# EAGLE design main (EAGLE 5.04)
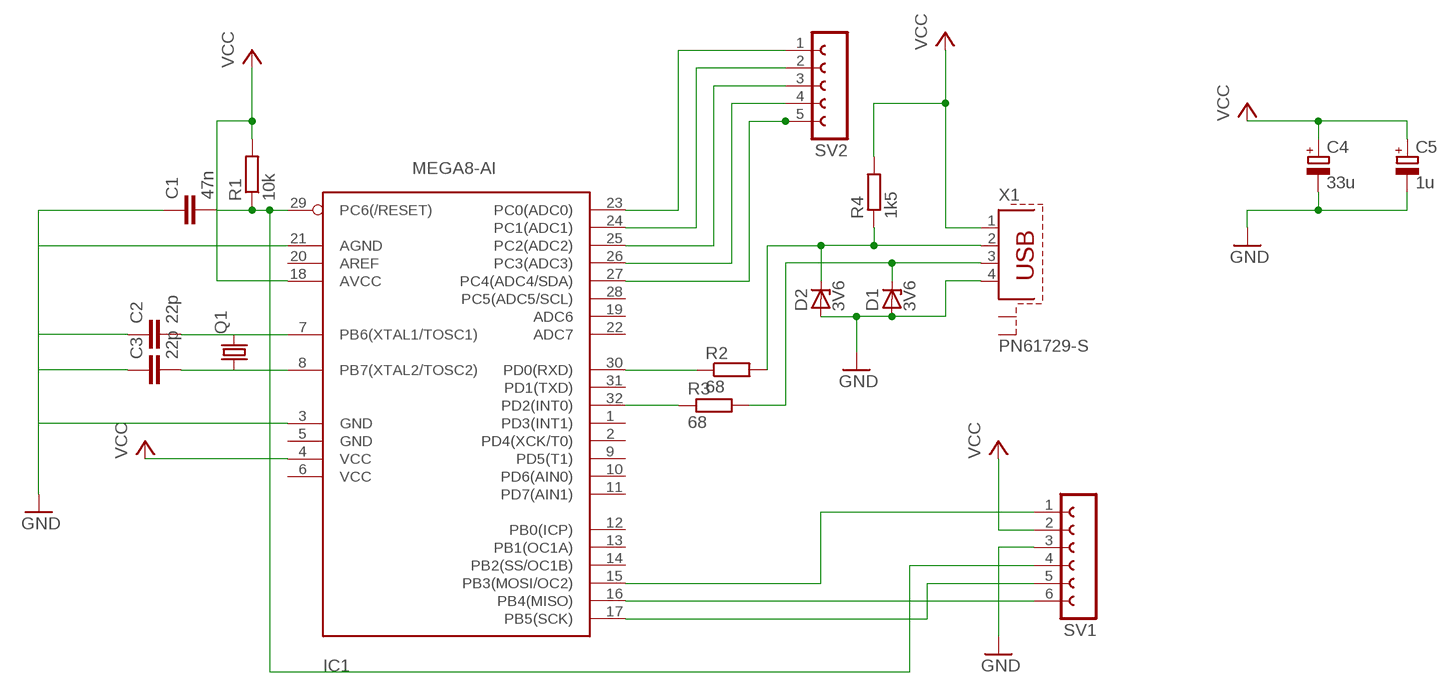
[diagram p0: schematic, sheet 1]

## Parts
C1  47n  C5/3  [C5B3]
C2  22p  C2.5/2  [C2.5-2]
C3  22p  C2.5/2  [C2.5-2]
C4  33u  CPOL-EUE2-4  [E2-4]
C5  1u  CPOL-EUE2-4  [E2-4]
D1  3V6  ZENER-DIODEDO34-7  [DO34Z7]
D2  3V6  ZENER-DIODEDO34-7  [DO34Z7]
IC1  MEGA8-AI  [TQFP32-08]
Q1  CRYSTALHC49S  [HC49/S]
R1  10k  R-EU_0207/10  [0207/10]
R2  68  R-EU_0207/10  [0207/10]
R3  68  R-EU_0207/10  [0207/10]
R4  1k5  R-EU_0207/10  [0207/10]
SV1  FE06-1  [FE06]
SV2  FE05-1  [FE05-1]
X1  PN61729-S  [PN61729-S]

## Nets
GND: C1.1 C2.1 C3.1 C4.- C5.- D1.A D2.A IC1.3(GND) IC1.21(AGND) SV1.3 X1.4
N$1: C2.2 IC1.7(PB6(XTAL1/TOSC1)) Q1.2
N$2: C3.2 IC1.8(PB7(XTAL2/TOSC2)) Q1.1
N$3: C1.2 IC1.29(PC6(/RESET)) R1.1 SV1.4
N$4: D1.C R3.2 X1.3
N$5: D2.C R2.2 R4.1 X1.2
N$6: IC1.15(PB3(MOSI/OC2)) SV1.1
N$7: IC1.32(PD2(INT0)) R3.1
N$8: IC1.30(PD0(RXD)) R2.1
N$9: IC1.16(PB4(MISO)) SV1.6
N$10: IC1.17(PB5(SCK)) SV1.5
N$11: IC1.23(PC0(ADC0)) SV2.1
N$12: IC1.24(PC1(ADC1)) SV2.2
N$13: IC1.25(PC2(ADC2)) SV2.3
N$14: IC1.26(PC3(ADC3)) SV2.4
N$15: IC1.27(PC4(ADC4/SDA)) SV2.5
VCC: C4.+ C5.+ IC1.4(VCC) IC1.18(AVCC) R1.2 R4.2 SV1.2 X1.1
Unconnected: IC1.1(PD3(INT1)) IC1.2(PD4(XCK/T0)) IC1.9(PD5(T1)) IC1.10(PD6(AIN0)) IC1.11(PD7(AIN1)) IC1.12(PB0(ICP)) IC1.13(PB1(OC1A)) IC1.14(PB2(SS/OC1B)) IC1.19(ADC6) IC1.20(AREF) IC1.22(ADC7) IC1.28(PC5(ADC5/SCL)) IC1.31(PD1(TXD)) X1.S1 X1.S2

## Power pins joined to a net without a drawn wire
GROUND: IC1.5(GND)
VCC: IC1.6(VCC)

## Library data of the parts
C1-C3 = capacitor-wima:C: CAPACITOR naming: grid - package width
C4 C5 = resistor:CPOL-EU: POLARIZED CAPACITOR, European symbol
D1 D2 = diode:ZENER-DIODE: Z-Diode
IC1 = atmel:MEGA8: MICROCONTROLLER 8 Kbytes FLASH, 1 kbytes SRAM, 512 bytes EEPROM, USART, 6-channel 10 bit ADC, 2-channel 8 bit ADC Pin compatible with Atmega48, ATMega88, ATMega168 Source: avr.lbr
Q1 = crystal:CRYSTAL: CRYSTAL
R1-R4 = resistor:R-EU_: RESISTOR, European symbol
SV1 = con-lsta:FE06-1: FEMALE HEADER
SV2 = con-lsta:FE05-1: FEMALE HEADER
X1 = con-berg:PN61729-S: BERG USB connector

## Board
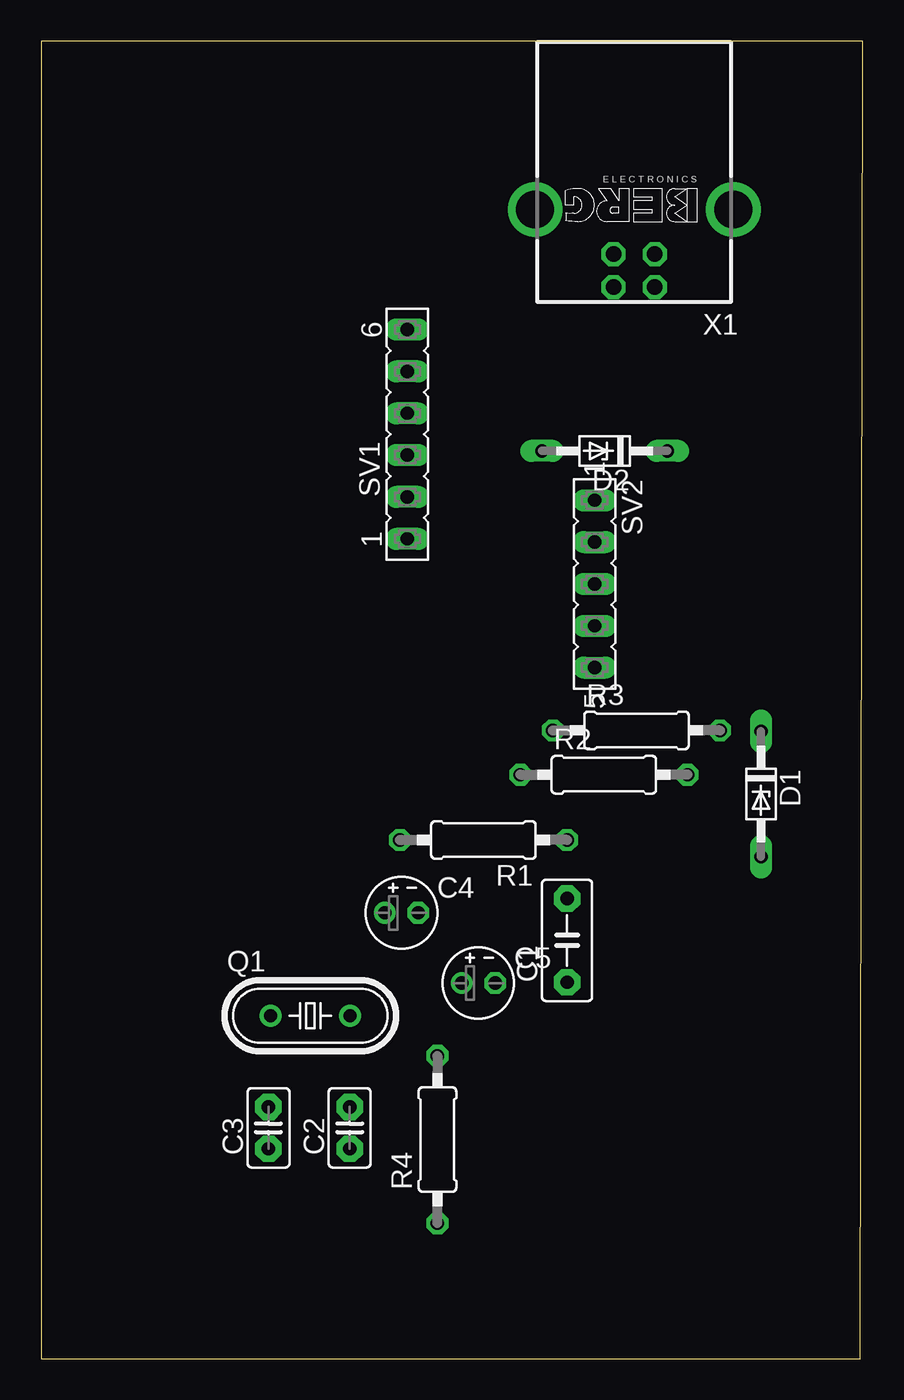
[diagram p1: board, top side]
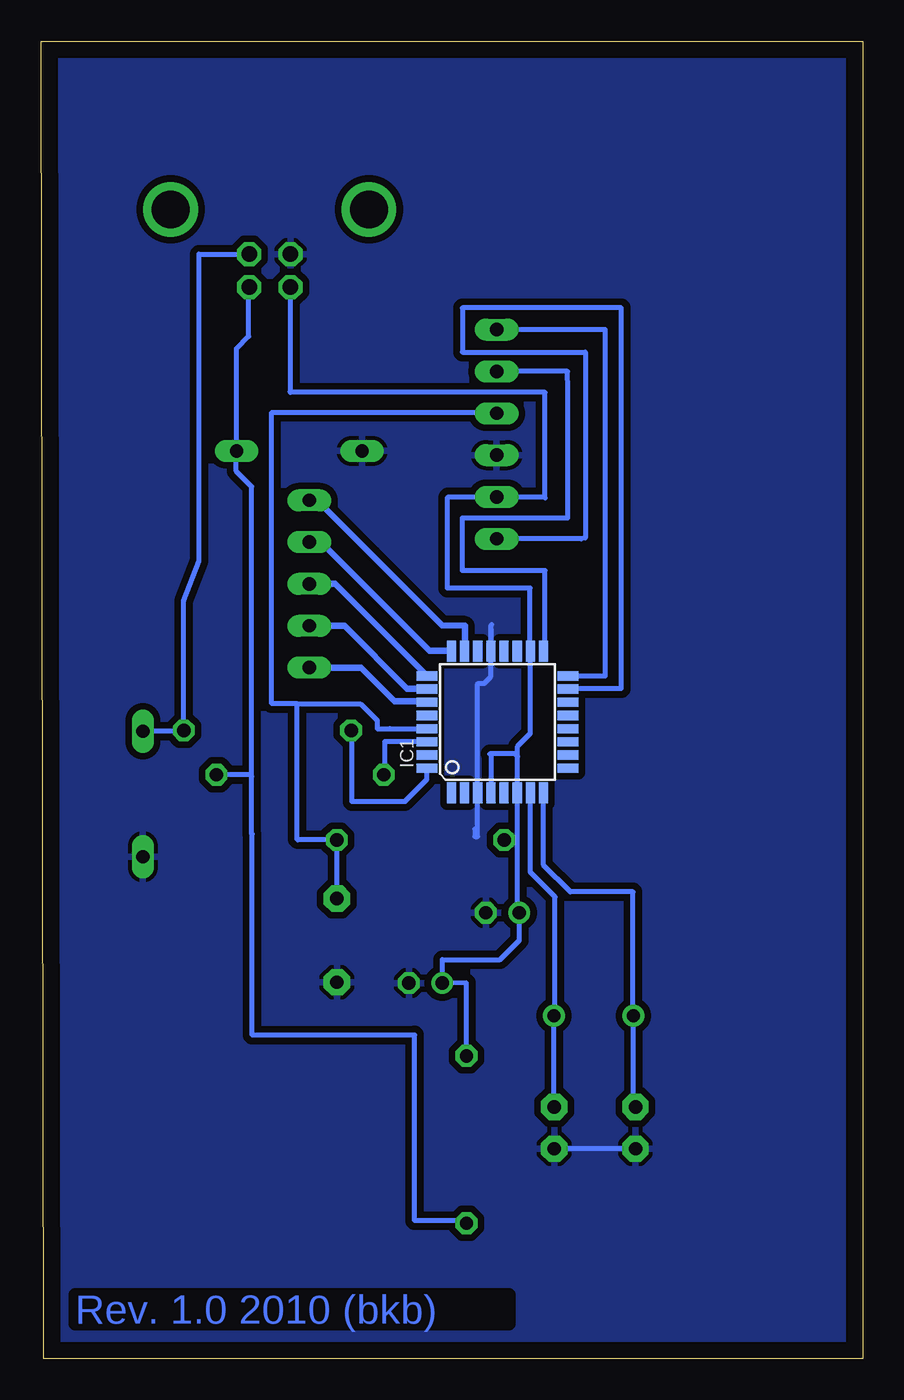
[diagram p2: board, bottom side, seen from below]

Size 49.91 x 80 mm. Coordinates in mm from the lower left corner, seen from the top.
Outline: 0,0 49.76,0 49.91,80 0,80 0,0
Copper layers (1*16): Top 0.035mm / dielectric 1.5mm / Bottom 0.035mm
Design rules "default": minimum track width 10mil, minimum drill 24mil, track to track 8mil, track to pad 8mil, pad to pad 8mil, via to via 8mil, smd to smd 8mil, copper to edge 40mil, drill to drill 8mil, minimum pad ring 10mil, minimum via ring 8mil, stop-mask expansion 4mil, vias tented up to drill 0mil, thermal gap 10mil

### Footprints (pad centres in the part's own frame; a part is rotated, then mirrored left to right if it is on the bottom)
C5B3 = drill 0.813 pad 1.6 octagon: 1 -2.54,0; 2 2.54,0
C2.5-2 = drill 0.813 pad 1.6 octagon: 1 -1.27,0; 2 1.27,0
E2-4 = drill 0.813 pad 1.27 round: + -1.016,0 | drill 0.813 pad 1.27 octagon: - 1.016,0
DO34Z7 = drill 0.813 long: A 3.81,0; C -3.81,0
TQFP32-08 = smd 1.27 x 0.559: 1 -4.293,2.8; 2 -4.293,2; 3 -4.293,1.2; 4 -4.293,0.4; 5 -4.293,-0.4; 6 -4.293,-1.2; 7 -4.293,-2; 8 -4.293,-2.8; 17 4.293,-2.8; 18 4.293,-2; 19 4.293,-1.2; 20 4.293,-0.4; 21 4.293,0.4; 22 4.293,1.2; 23 4.293,2; 24 4.293,2.8 | smd 0.559 x 1.27: 9 -2.8,-4.293; 10 -2,-4.293; 11 -1.2,-4.293; 12 -0.4,-4.293; 13 0.4,-4.293; 14 1.2,-4.293; 15 2,-4.293; 16 2.8,-4.293; 25 2.8,4.293; 26 2,4.293; 27 1.2,4.293; 28 0.4,4.293; 29 -0.4,4.293; 30 -1.2,4.293; 31 -2,4.293; 32 -2.8,4.293
HC49/S = drill 0.813 round: 1 -2.413,0; 2 2.413,0
0207/10 = drill 0.813 octagon: 1 -5.08,0; 2 5.08,0
FE06 = drill 0.813 long: 1 -6.35,0; 2 -3.81,0; 3 -1.27,0; 4 1.27,0; 5 3.81,0; 6 6.35,0
FE05-1 = drill 0.813 long: 1 -5.08,0; 2 -2.54,0; 3 0,0; 4 2.54,0; 5 5.08,0
PN61729-S = drill 0.95 octagon: 1 1.25,4.71; 2 -1.25,4.71; 3 -1.25,2.71; 4 1.25,2.71 | drill 2.3 pad 2.9 round: S1 -6.02,0; S2 6.02,0

### Placement (x,y rotation side)
C1  31.95,25.4 90 top
C2  18.74,14.03 90 top
C3  13.81,14.03 90 top
C4  21.89,27.08 0 top
C5  26.56,22.81 0 top
D1  43.73,34.29 270 top
D2  34.23,55.12 180 top
IC1  22.19,38.66 90 bottom
Q1  16.35,20.83 0 top
R1  26.87,31.5 180 top
R2  34.18,35.46 0 top
R3  36.16,38.16 0 top
R4  24.07,13.31 90 top
SV1  22.24,56.14 90 top
SV2  33.62,47.05 270 top
X1  36.03,69.78 180 top

### Tracks (layer width: path | path; a pad name or v marks a point on that pad's centre or on a via)
GND
  Bottom 0.305: 18.79,12.81 C2.1 C3.1 | 23.41,32.16 23.57,32.16 23.57,31.7 23.39,31.7 IC1.3 23.39,40.98 23.37,41.01 23,41.01 22.59,41.41 22.59,44.32 | 22.59,44.32 22.59,44.51 22.53,44.57 | IC1.21 22.59,44.32
  pour Bottom (isolate 0.406): 0,80 50,80 50,0 0,0
N$1
  Bottom 0.305: IC1.7 20.19,29.55 18.69,28.05 18.69,20.91 Q1.2 18.77,15.32 C2.2
N$2
  Bottom 0.305: IC1.8 19.39,29.97 17.77,28.35 13.96,28.35 13.96,20.86 Q1.1 13.94,15.42 C3.2
N$3
  Bottom 0.305: 34.39,39.66 34.39,39.78 35.91,39.78 35.91,57.46 22.19,57.46 SV1.4 | IC1.29 28.74,38.26 28.75,38.26 29.51,38.26 29.51,38.77 30.52,39.77 34.27,39.77 34.39,39.66 | C1.2 R1.1 34.32,31.5 34.38,31.56 34.38,39.65 34.39,39.66
N$4
  Bottom 0.305: D1.C 41.29,38.1 R3.2 41.24,46.03 40.33,48.47 40.33,67.07 X1.3
N$5
  Bottom 0.305: R2.2 37.23,35.46 37.13,35.36 | 37.13,35.36 37.13,31.86 37.09,31.86 37.09,19.66 27.22,19.66 | R4.1 24.23,8.39 27.22,8.39 27.22,19.66 | 37.13,35.36 37.13,52.96 38.07,53.9 38.07,55.1 D2.C 38.04,61.34 37.31,62.07 37.31,65.04 X1.2 | 27.22,19.66
N$6
  Bottom 0.305: IC1.15 17.87,40.7 14.68,40.7 14.68,63.81 24.33,63.81 24.33,61.12 16.86,61.12 16.86,49.84 17.11,49.79 SV1.1
N$7
  Bottom 0.305: IC1.32 26.49,35.18 27.83,33.84 31.03,33.84 31.03,38.1 R3.1
N$8
  Bottom 0.305: IC1.30 29.02,37.46 29.05,37.49 29.05,35.51 R2.1
N$9
  Bottom 0.305: IC1.16 15.64,41.46 15.64,62.49 SV1.6
N$10
  Bottom 0.305: IC1.17 19.3,43.05 19.3,47.86 24.33,47.86 24.33,51.06 17.93,51.06 17.93,58.83 17.94,59.95 SV1.5
N$11
  Bottom 0.406: 24.18,42.96 IC1.23 24.18,42.97 24.18,44.51 25.57,44.54 29.84,48.81 30.27,49.23 33.17,52.12 SV2.1
N$12
  Bottom 0.406: SV2.2 32.91,49.59 26.31,42.98 25.02,42.98 IC1.24
N$13
  Bottom 0.406: SV2.3 32.07,47.05 IC1.25
N$14
  Bottom 0.406: SV2.4 31.49,44.51 27.68,40.7 26.52,40.7 IC1.26
N$15
  Bottom 0.406: SV2.5 30.47,41.97 28.44,39.93 26.56,39.93 IC1.27
VCC
  Bottom 0.305: 20.97,36.58 20.97,37.19 20.19,37.97 IC1.18 20.21,42.97 20.21,46.79 25.24,46.79 25.24,52.28 25.19,52.33 SV1.2 19.35,52.33 19.3,52.28 19.3,58.68 34.78,58.68 34.78,58.75 X1.1 | 20.97,36.58 20.97,34.39 IC1.6 20.99,31.55 | IC1.4 22.59,36.67 22.65,36.73 21.13,36.73 20.97,36.58 | 20.99,31.55 20.99,27.05 C4.+ 20.87,25.4 22.04,24.24 25.55,24.24 C5.+ 24.08,22.82 R4.2 | R1.2 21.79,31.55 20.99,31.55

### Text on the board
Bottom: Rev. 1.0 2010 (bkb)